# Altium schematic sheet Flash.SchDoc
size A4; SheetNumber: 6; SheetTotal: 15
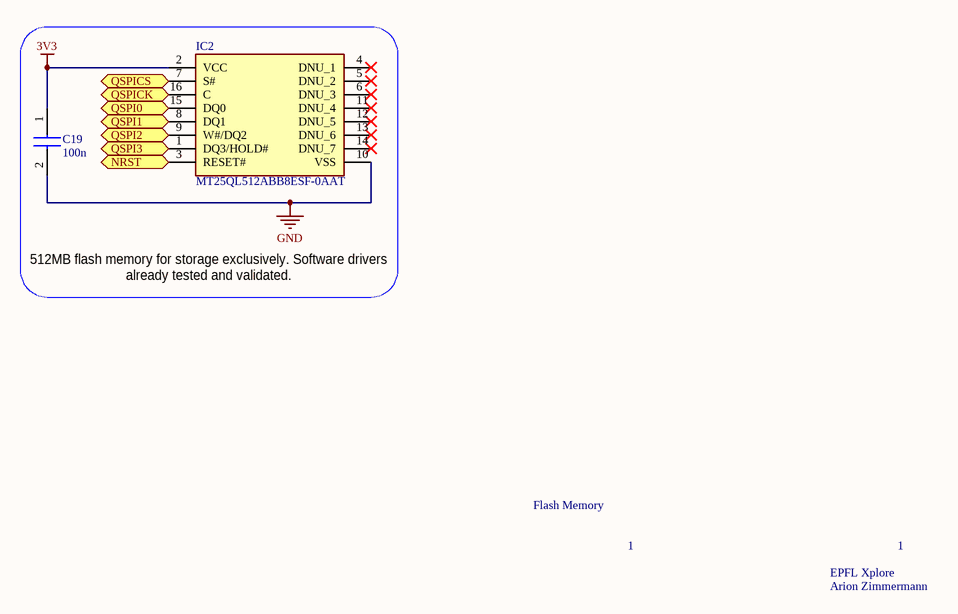
[diagram p0: Flash.SchDoc]

## Parts
C19  value 100n  [CAPC1608X95N]  (hidden comment: C0603C104K5RACTU)
IC2  MT25QL512ABB8ESF-0AAT  [SOIC127P1032X265-16N]

## Ports
NRST (bidir), QSPI0 (bidir), QSPI1 (bidir), QSPI2 (bidir), QSPI3 (bidir), QSPICK (bidir), QSPICS (bidir)

## Nets
3V3: C19.1 IC2.2(VCC)
GND: C19.2 IC2.10(VSS)
NRST: IC2.3(RESET#) ; port NRST
QSPI0: IC2.15(DQ0) ; port QSPI0
QSPI1: IC2.8(DQ1) ; port QSPI1
QSPI2: IC2.9(W#/DQ2) ; port QSPI2
QSPI3: IC2.1(DQ3/HOLD#) ; port QSPI3
QSPICK: IC2.16(C) ; port QSPICK
QSPICS: IC2.7(S#) ; port QSPICS

Not connected (* = marked no-connect by the designer): IC2 4(DNU_1)* 5(DNU_2)* 6(DNU_3)* 11(DNU_4)* 12(DNU_5)* 13(DNU_6)* 14(DNU_7)*

## Notes on the sheet
- 512MB flash memory for storage exclusively. Software drivers already tested and validated.
- Flash Memory
- 1
- EPFL Xplore
- Arion Zimmermann

## Library data of the parts
C19 = C0603C104K5RACTU: Capacitor; Manufacturer_Name: Kemet; Datasheet Link: http://www.farnell.com/datasheets/2205446.pdf; Height: 0.95mm; Manufacturer_Part_Number: C0603C104K5RACTU; Mouser Part Number: 80-C0603C104K5R; Mouser Price/Stock: https://www.mouser.co.uk/ProductDetail/KEMET/C0603C104K5RACTU?qs=l5k%252BbMnNDkkVcnZPSAaaiQ%3D%3D; Arrow Part Number: C0603C104K5RACTU; Arrow Price/Stock: https://www.arrow.com/en/products/c0603c104k5ractu/kemet-corporation; Supplier 1: Mouser; Supplier Part Number 1: 80-C0603C104K5R
IC2 = MT25QL512ABB8ESF-0AAT: Integrated Circuit; Manufacturer_Name: Micron; Datasheet Link: https://media-www.micron.com/-/media/client/global/documents/products/data-sheet/nor-flash/serial-nor/mt25q/die-rev-b/mt25q_qlkt_l_512_abb_0.pdf?rev=0ef0faa5f7b645d7bc11c30bfd27505b; Height: 2.65mm; Manufacturer_Part_Number: MT25QL512ABB8ESF-0AAT; Mouser Part Number: 340-285789-TRAY; Mouser Price/Stock: https://www.mouser.co.uk/ProductDetail/Micron/MT25QL512ABB8ESF-0AAT?qs=rrS6PyfT74da2PZ8DoLIJg%3D%3D; Arrow Part Number: MT25QL512ABB8ESF-0AAT; Arrow Price/Stock: https://www.arrow.com/en/products/mt25ql512abb8esf-0aat/micron-technology; Supplier 1: Mouser; Supplier Part Number 1: 340-285789-TRAY